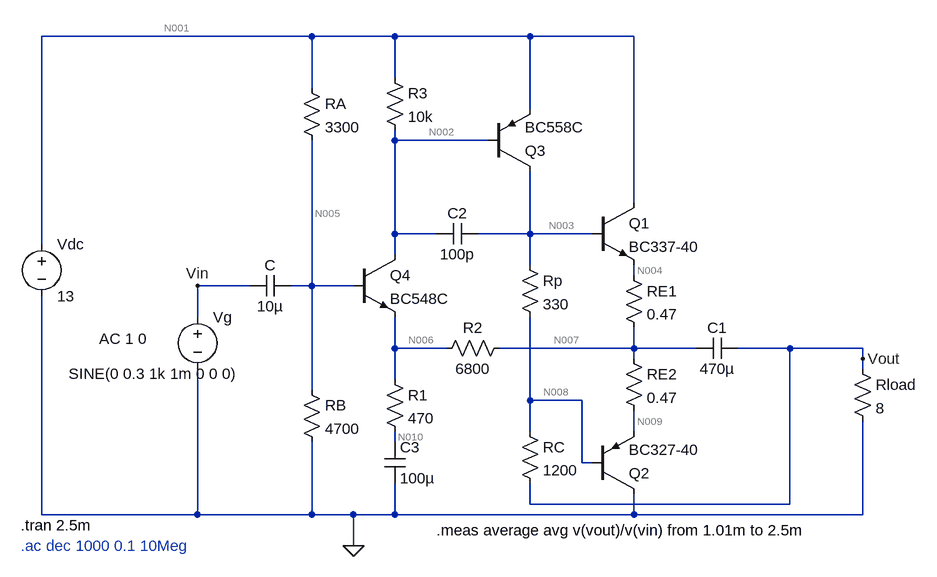
[diagram p0: schematic Ampli Completo.asc]
Ampli Completo.asc, the LTspice schematic file:
Version 4
SHEET 1 2240 680
WIRE 112 -320 -304 -320
WIRE 240 -320 112 -320
WIRE 448 -320 240 -320
WIRE 608 -320 448 -320
WIRE 240 -256 240 -320
WIRE 112 -240 112 -320
WIRE 448 -208 448 -320
WIRE 240 -160 240 -176
WIRE 384 -160 240 -160
WIRE 608 -64 608 -320
WIRE 240 -16 240 -160
WIRE 304 -16 240 -16
WIRE 448 -16 448 -112
WIRE 448 -16 368 -16
WIRE 544 -16 448 -16
WIRE -304 0 -304 -320
WIRE 240 16 240 -16
WIRE 448 32 448 -16
WIRE 608 48 608 32
WIRE 16 64 -64 64
WIRE 112 64 112 -160
WIRE 112 64 80 64
WIRE 176 64 112 64
WIRE -64 112 -64 64
WIRE 240 160 240 112
WIRE 320 160 240 160
WIRE 608 160 608 128
WIRE 608 160 400 160
WIRE 704 160 608 160
WIRE 848 160 768 160
WIRE 960 160 848 160
WIRE 608 176 608 160
WIRE 960 176 960 160
WIRE 960 192 960 176
WIRE 240 208 240 160
WIRE 112 224 112 64
WIRE 448 240 448 112
WIRE 528 240 448 240
WIRE 448 288 448 240
WIRE 608 288 608 256
WIRE 240 304 240 288
WIRE 528 336 528 240
WIRE 544 336 528 336
WIRE 448 400 448 368
WIRE 848 400 848 160
WIRE 848 400 448 400
WIRE -304 416 -304 80
WIRE -64 416 -64 192
WIRE -64 416 -304 416
WIRE 112 416 112 304
WIRE 112 416 -64 416
WIRE 176 416 112 416
WIRE 240 416 240 368
WIRE 240 416 176 416
WIRE 608 416 608 384
WIRE 608 416 240 416
WIRE 960 416 960 272
WIRE 960 416 608 416
WIRE 176 464 176 416
FLAG 960 176 Vout
FLAG -64 64 Vin
FLAG 176 464 0
SYMBOL voltage -64 96 R0
WINDOW 3 -198 103 Left 2
WINDOW 123 -151 49 Left 2
WINDOW 39 0 0 Left 0
SYMATTR Value SINE(0 0.3 1k 1m 0 0 0)
SYMATTR Value2 AC 1 0
SYMATTR InstName Vg
SYMBOL cap 80 48 R90
WINDOW 0 0 32 VBottom 2
WINDOW 3 32 32 VTop 2
SYMATTR InstName C
SYMATTR Value 10µ
SYMBOL npn 176 16 R0
SYMATTR InstName Q4
SYMATTR Value BC548C
SYMBOL res 224 -272 R0
SYMATTR InstName R3
SYMATTR Value 10k
SYMBOL res 224 192 R0
SYMATTR InstName R1
SYMATTR Value 470
SYMBOL cap 368 -32 R90
WINDOW 0 0 32 VBottom 2
WINDOW 3 32 32 VTop 2
SYMATTR InstName C2
SYMATTR Value 100p
SYMBOL res 944 176 R0
SYMATTR InstName Rload
SYMATTR Value 8
SYMBOL cap 768 144 R90
WINDOW 0 0 32 VBottom 2
WINDOW 3 32 32 VTop 2
SYMATTR InstName C1
SYMATTR Value 470µ
SYMBOL pnp 384 -112 M180
SYMATTR InstName Q3
SYMATTR Value BC558C
SYMBOL res 416 144 R90
WINDOW 0 0 56 VBottom 2
WINDOW 3 32 56 VTop 2
SYMATTR InstName R2
SYMATTR Value 6800
SYMBOL cap 224 304 R0
SYMATTR InstName C3
SYMATTR Value 100µ
SYMBOL voltage -304 -16 R0
SYMATTR InstName Vdc
SYMATTR Value 13
SYMBOL npn 544 -64 R0
SYMATTR InstName Q1
SYMATTR Value BC337-40
SYMBOL res 592 32 R0
SYMATTR InstName RE1
SYMATTR Value 0.47
SYMBOL pnp 544 384 M180
SYMATTR InstName Q2
SYMATTR Value BC327-40
SYMBOL res 592 160 R0
SYMATTR InstName RE2
SYMATTR Value 0.47
SYMBOL res 432 16 R0
SYMATTR InstName Rp
SYMATTR Value 330
SYMBOL res 432 272 R0
SYMATTR InstName RC
SYMATTR Value 1200
SYMBOL res 96 -256 R0
SYMATTR InstName RA
SYMATTR Value 3300
SYMBOL res 96 208 R0
SYMATTR InstName RB
SYMATTR Value 4700
TEXT -336 432 Left 2 !.tran 2.5m
TEXT -336 464 Left 2 ;.ac dec 1000 0.1 10Meg
TEXT 304 440 Left 2 !.meas average avg v(vout)/v(vin) from 1.01m to 2.5m

The netlist it stands for:
* Ampli Completo.asc
Vg Vin 0 SINE(0 0.3 1k 1m 0 0 0) AC 1 0
C N005 Vin 10µ
Q4 N002 N005 N006 0 BC548C
R3 N001 N002 10k
R1 N006 N010 470
C2 N003 N002 100p
Rload Vout 0 8
C1 Vout N007 470µ
Q3 N003 N002 N001 0 BC558C
R2 N007 N006 6800
C3 N010 0 100µ
Vdc N001 0 13
Q1 N001 N003 N004 0 BC337-40
RE1 N004 N007 0.47
Q2 0 N008 N009 0 BC327-40
RE2 N007 N009 0.47
Rp N003 N008 330
RC N008 Vout 1200
RA N001 N005 3300
RB N005 0 4700
.model NPN NPN
.model PNP PNP
.lib standard.bjt
.tran 2.5m
* .ac dec 1000 0.1 10Meg
.meas average avg v(vout)/v(vin) from 1.01m to 2.5m
.backanno
.end

* Results of the author's LTspice run, read from the files saved beside the schematic
* Operating Point, zero values left out:
*   V(n005) = 7.637 V
*   V(n002) = 12.25 V
*   V(n006) = 7.068 V
*   V(n001) = 13 V
*   V(n010) = 7.068 V
*   V(n003) = 7.249 V
*   V(vout) = 38.03 mV
*   V(n007) = 6.486 V
*   V(n004) = 6.522 V
*   V(n008) = 5.743 V
*   V(n009) = 6.45 V
*   Ic(Q4) = 85.37 µA
*   Ib(Q4) = 201.4 nA
*   Ie(Q4) = -85.57 µA
*   Ic(Q3) = -4.754 mA
*   Ib(Q3) = -10.23 µA
*   Ie(Q3) = 4.764 mA
*   Ic(Q1) = 76.38 mA
*   Ib(Q1) = 191.3 µA
*   Ie(Q1) = -76.57 mA
*   Ic(Q2) = -76.46 mA
*   Ib(Q2) = -192 µA
*   Ie(Q2) = 76.65 mA
*   I(R3) = 75.14 µA
*   I(Rload) = 4.754 mA
*   I(R2) = -85.57 µA
*   I(Re1) = 76.57 mA
*   I(Re2) = 76.65 mA
*   I(Rp) = 4.562 mA
*   I(Rc) = 4.754 mA
*   I(Ra) = 1.625 mA
*   I(Rb) = 1.625 mA
*   I(Vdc) = -82.84 mA
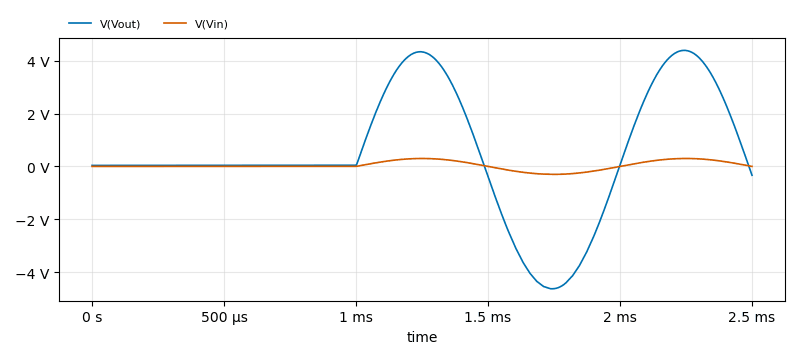
[diagram p1: Transient Analysis of Ampli Completo.asc, plotted from the saved traces]
* Transient Analysis, 1 run:
*   V(Vout): min -4.625 V, max 4.386 V, average 499.6 mV, rms 2.438 V, last -332.9 mV
*   V(Vin): min -300 mV, max 300 mV, average 38.25 mV, rms 164.3 mV, last 0 V
* From the log:
*   average: AVG(v(vout)/v(vin))=14.5744 FROM 0.00101 TO 0.0025